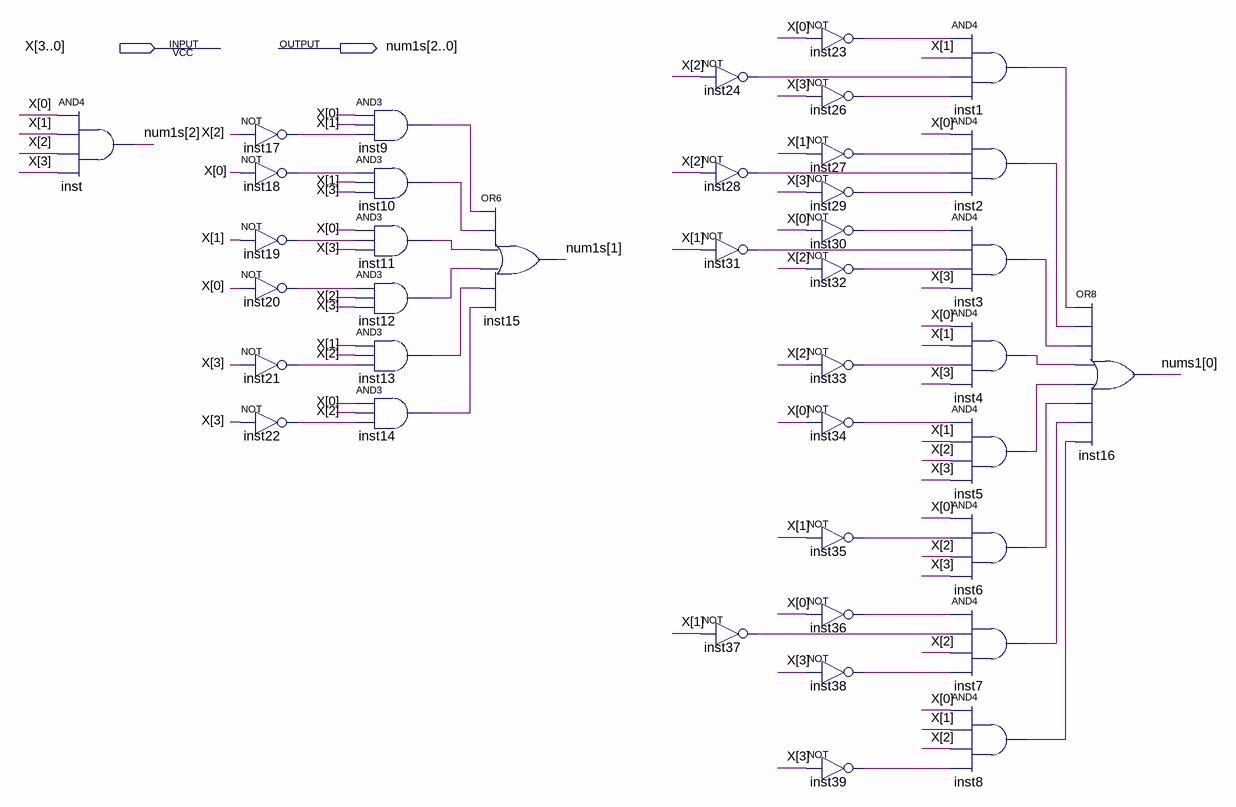
[diagram p0: schematic sheet]
// Quartus schematic g05_num1s.bdf as structural Verilog: 39 symbols, 2 pins
module g05_num1s (
  input  [3:0] X,
  output [2:0] num1s
);

  wire inst1_out, inst2_out, inst3_out, inst4_out, inst5_out, inst6_out, inst7_out, inst8_out, inst9_out,
       inst10_out, inst11_out, inst12_out, inst13_out, inst14_out, inst17_out, inst18_out, inst19_out,
       inst20_out, inst21_out, inst22_out, inst23_out, inst24_out, inst26_out, inst27_out, inst28_out,
       inst29_out, inst30_out, inst31_out, inst32_out, inst33_out, inst34_out, inst35_out, inst36_out,
       inst37_out, inst38_out, inst39_out;
  wire [0:0] nums1;

  and inst (num1s[2], X[0], X[1], X[2], X[3]);
  not inst17 (inst17_out, X[2]);
  not inst18 (inst18_out, X[0]);
  not inst19 (inst19_out, X[1]);
  not inst20 (inst20_out, X[0]);
  not inst21 (inst21_out, X[3]);
  not inst22 (inst22_out, X[3]);
  and inst9 (inst9_out, X[0], X[1], inst17_out);
  and inst10 (inst10_out, inst18_out, X[1], X[3]);
  and inst11 (inst11_out, X[0], inst19_out, X[3]);
  and inst12 (inst12_out, inst20_out, X[2], X[3]);
  and inst13 (inst13_out, X[1], X[2], inst21_out);
  and inst14 (inst14_out, X[0], X[2], inst22_out);
  or inst15 (num1s[1], inst9_out, inst10_out, inst11_out, inst12_out, inst13_out, inst14_out);
  not inst24 (inst24_out, X[2]);
  not inst28 (inst28_out, X[2]);
  not inst31 (inst31_out, X[1]);
  not inst37 (inst37_out, X[1]);
  not inst23 (inst23_out, X[0]);
  not inst26 (inst26_out, X[3]);
  not inst27 (inst27_out, X[1]);
  not inst29 (inst29_out, X[3]);
  not inst30 (inst30_out, X[0]);
  not inst32 (inst32_out, X[2]);
  not inst33 (inst33_out, X[2]);
  not inst34 (inst34_out, X[0]);
  not inst35 (inst35_out, X[1]);
  not inst36 (inst36_out, X[0]);
  not inst38 (inst38_out, X[3]);
  not inst39 (inst39_out, X[3]);
  and inst1 (inst1_out, inst23_out, X[1], inst24_out, inst26_out);
  and inst2 (inst2_out, X[0], inst27_out, inst28_out, inst29_out);
  and inst3 (inst3_out, inst30_out, inst31_out, inst32_out, X[3]);
  and inst4 (inst4_out, X[0], X[1], inst33_out, X[3]);
  and inst5 (inst5_out, inst34_out, X[1], X[2], X[3]);
  and inst6 (inst6_out, X[0], inst35_out, X[2], X[3]);
  and inst7 (inst7_out, inst36_out, inst37_out, X[2], inst38_out);
  and inst8 (inst8_out, X[0], X[1], X[2], inst39_out);
  or inst16 (nums1[0], inst1_out, inst2_out, inst3_out, inst4_out, inst5_out, inst6_out, inst7_out, inst8_out);
endmodule
